# Altium schematic sheet Top_Level_Underwater_ROV_PDB.SchDoc
size A
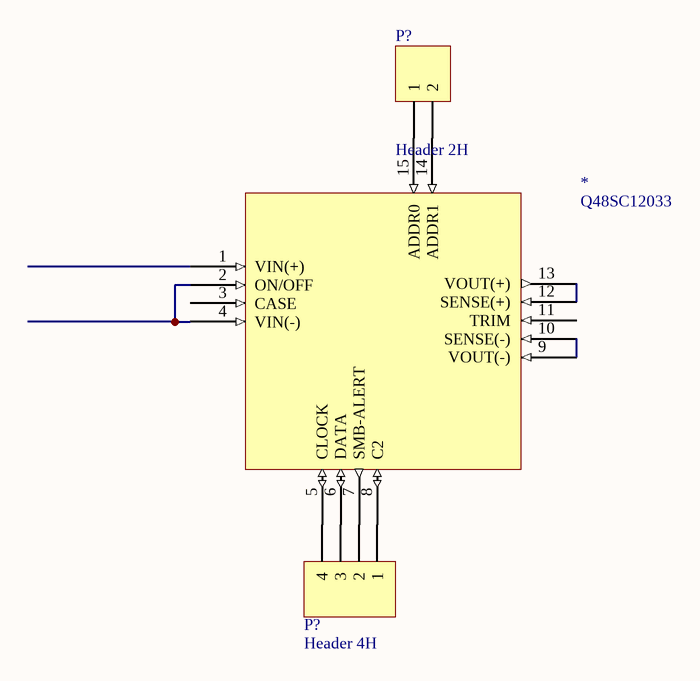
[diagram p0: Top_Level_Underwater_ROV_PDB.SchDoc]

## Parts
(Parts that share a designator on the sheet are numbered #1, #2 ... from top to bottom, then left to right.)
*  Q48SC12033
P?#1  Header 2H  [HDR1X2H]
P?#2  Header 4H  [HDR1X4H]

## Nets
Net*_2: *.2(ON/OFF) *.4(VIN(-))
Net*_5: *.5(CLOCK) P?#2.4
Net*_6: *.6(DATA) P?#2.3
Net*_7: *.7(SMB-ALERT) P?#2.2
Net*_8: *.8(C2) P?#2.1
Net*_9: *.9(VOUT(-)) *.10(SENSE(-))
Net*_12: *.12(SENSE(+)) *.13(VOUT(+))
Net*_14: *.14(ADDR1) P?#1.2
Net*_15: *.15(ADDR0) P?#1.1

Not connected (* = marked no-connect by the designer): * 1(VIN(+)) 3(CASE) 11(TRIM)

## Library data of the parts
P?#1 = Header 2H: Header, 2-Pin, Right Angle; LatestRevisionDate: 17-Jul-2002; LatestRevisionNote: Re-released for DXP Platform.; Publisher: Altium Limited
P?#2 = Header 4H: Header, 4-Pin, Right Angle; LatestRevisionDate: 17-Jul-2002; LatestRevisionNote: Re-released for DXP Platform.; Publisher: Altium Limited